# EAGLE design MJ515 - rev.1 - TCAN334 - poc (EAGLE 9.6.2)
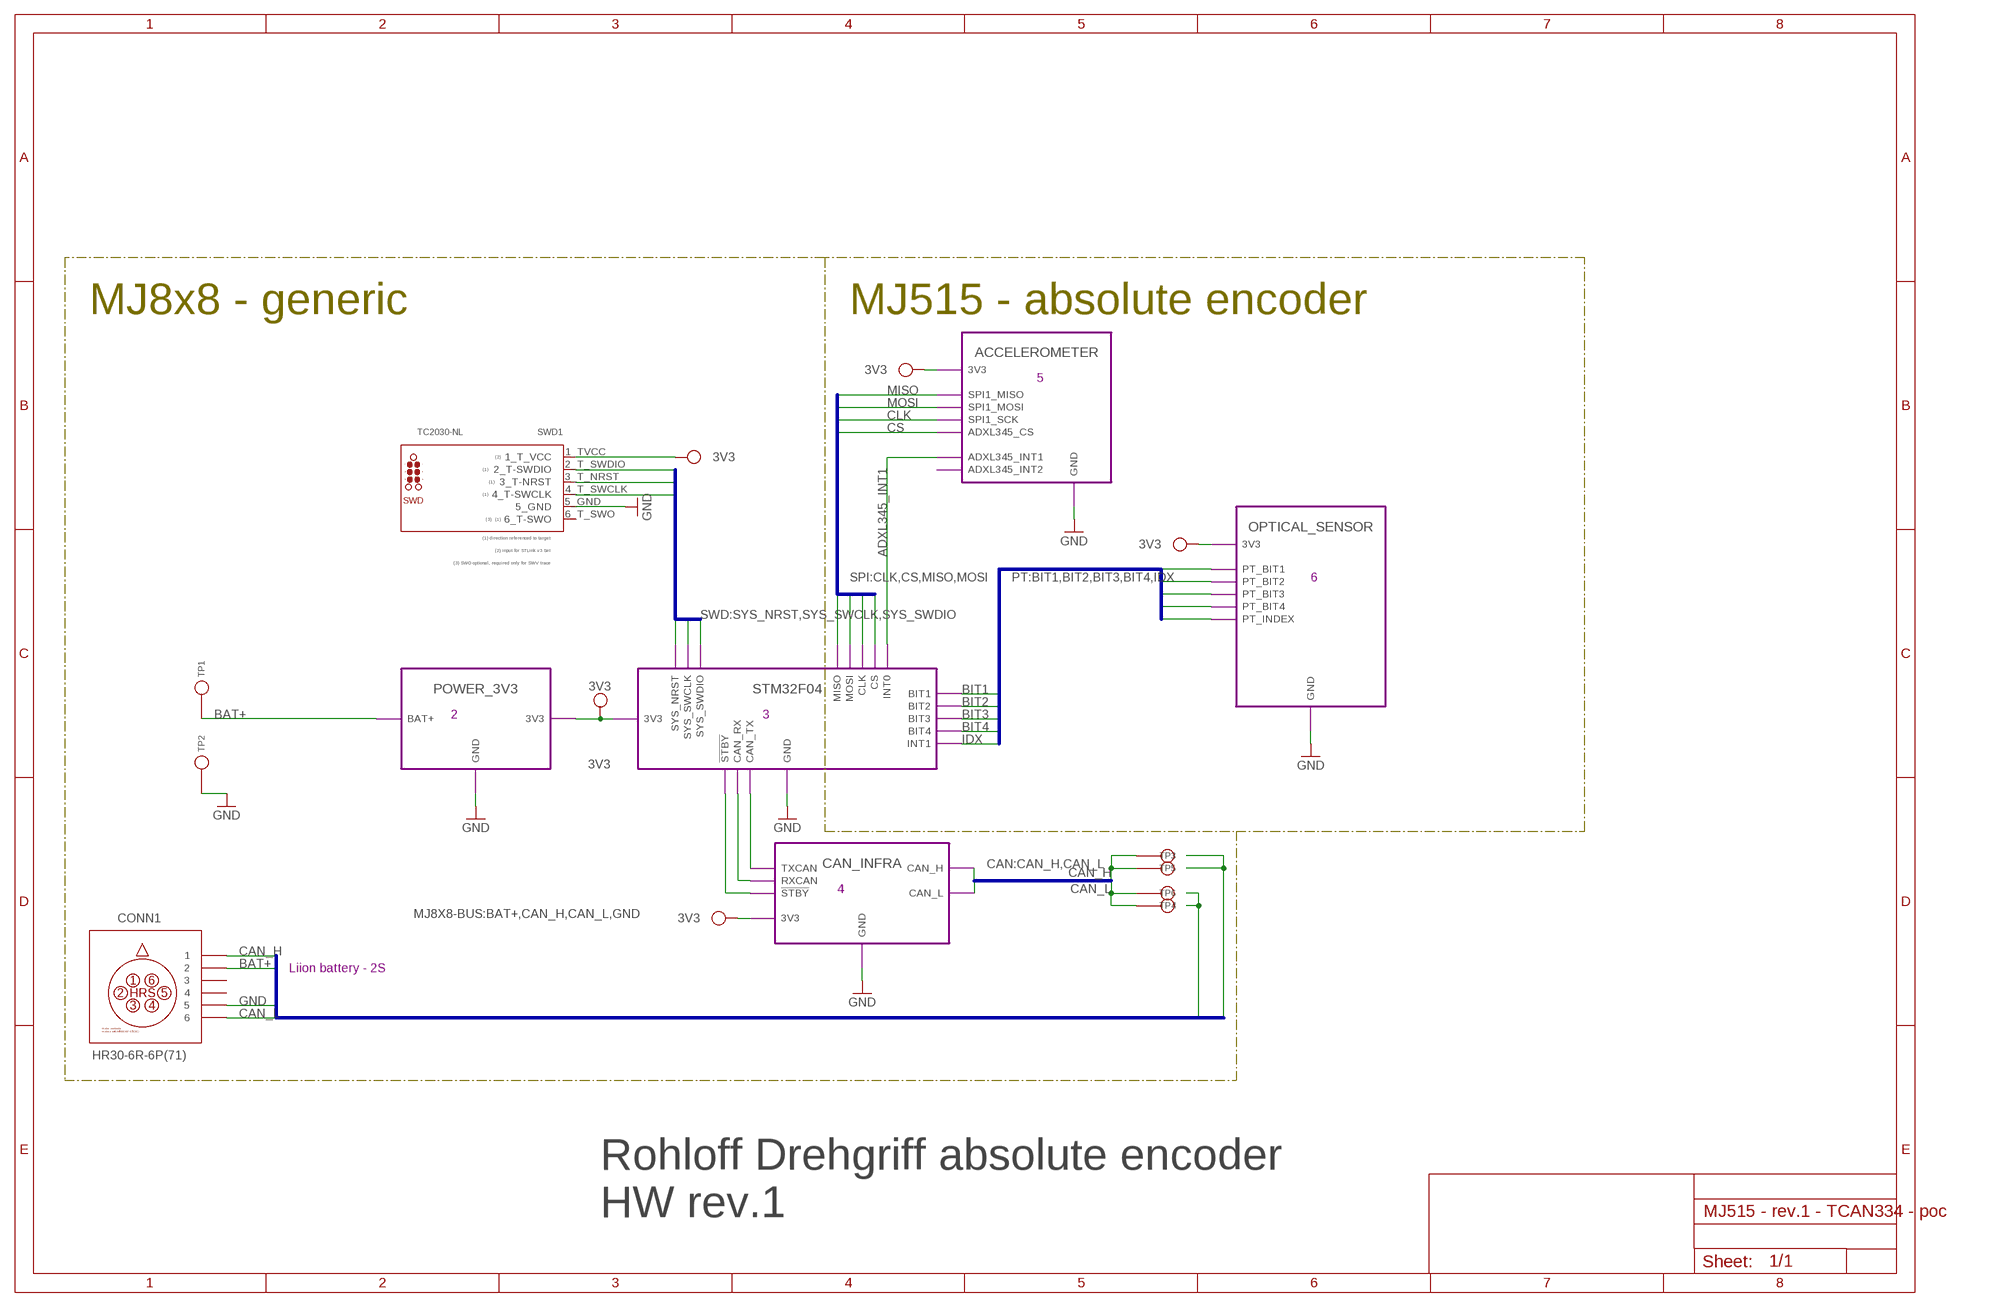
[diagram p0: schematic, sheet 1]

## Parts
CONN1  HR30-6R-6P(71)  HR-30-6R-6X  (no package)
SWD1  TC2030-NL  TC2030  [TC2030-NL]
TP1  LiIon + Terminal  TPTH-0.9  [TH-0.9]
TP2  LiIon - Terminal  TPTH-0.9  [TH-0.9]
TP3  CAN high  TPTH-0.9  [TH-0.9]
TP4  CAN low  TPTH-0.9  [TH-0.9]
TP5  CAN high  TPTH-0.9  [TH-0.9]
TP6  CAN low  TPTH-0.9  [TH-0.9]

## Module instances
POWER_3V3 = POWER_3V3 (part numbers offset by 200)
STM32F04 = STM32 (part numbers offset by 300)
CAN_INFRA = CAN_INFRA (part numbers offset by 400)
ACCELEROMETER = ACCELEROMETER (part numbers offset by 500)
OPTICAL_SENSOR = OPTICAL_SENSOR (part numbers offset by 600)

## Nets
3V3 [3V3]: SWD1.1_TVCC(1_T_VCC) ; port STM32F04.3V3 POWER_3V3.3V3 CAN_INFRA.3V3 OPTICAL_SENSOR.3V3 ACCELEROMETER.3V3
!STBY! [signal]: port CAN_INFRA.!STBY! STM32F04.!STBY!
ADXL345_INT1 [signal]: port ACCELEROMETER.ADXL345_INT1 STM32F04.INT0
BAT+ [BAT+]: CONN1.2 TP1.P$1(TP$1) ; port POWER_3V3.BAT+
BIT1 [signal]: port STM32F04.BIT1 OPTICAL_SENSOR.PT_BIT1
BIT2 [signal]: port STM32F04.BIT2 OPTICAL_SENSOR.PT_BIT2
BIT3 [signal]: port STM32F04.BIT3 OPTICAL_SENSOR.PT_BIT3
BIT4 [signal]: port STM32F04.BIT4 OPTICAL_SENSOR.PT_BIT4
CAN_H [signal]: CONN1.1 TP3.P$1(TP$1) TP5.P$1(TP$1) ; port CAN_INFRA.CAN_H
CAN_L [signal]: CONN1.6 TP4.P$1(TP$1) TP6.P$1(TP$1) ; port CAN_INFRA.CAN_L
CAN_RX [signal]: port CAN_INFRA.RXCAN STM32F04.CAN_RX
CAN_TX [signal]: port CAN_INFRA.TXCAN STM32F04.CAN_TX
CLK [signal]: port ACCELEROMETER.SPI1_SCK STM32F04.CLK
CS [signal]: port ACCELEROMETER.ADXL345_CS STM32F04.CS
GND: CONN1.5 SWD1.5_GND TP2.P$1(TP$1) ; port STM32F04.GND POWER_3V3.GND CAN_INFRA.GND ACCELEROMETER.GND OPTICAL_SENSOR.GND
IDX [signal]: port STM32F04.INT1 OPTICAL_SENSOR.PT_INDEX
MISO [signal]: port ACCELEROMETER.SPI1_MISO STM32F04.MISO
MOSI [signal]: port ACCELEROMETER.SPI1_MOSI STM32F04.MOSI
SYS_NRST [signal]: SWD1.3_T_NRST(3_T-NRST) ; port STM32F04.SYS_NRST
SYS_SWCLK [signal]: SWD1.4_T_SWCLK(4_T-SWCLK) ; port STM32F04.SYS_SWCLK
SYS_SWDIO [signal]: SWD1.2_T_SWDIO(2_T-SWDIO) ; port STM32F04.SYS_SWDIO
Unconnected: CONN1.3 CONN1.4 SWD1.6_T_SWO(6_T-SWO)

## Buses
CAN:CAN_H,CAN_L
SWD:SYS_NRST,SYS_SWCLK,SYS_SWDIO
MJ8X8-BUS:BAT+,CAN_H,CAN_L,GND
SPI:CLK,CS,MISO,MOSI
PT:BIT1,BIT2,BIT3,BIT4,IDX

## Notes on the sheet
- MJ8x8 - generic | MJ515 - absolute encoder
- 5
- 6
- 2 | 3
- 4
- Liion battery - 2S
- Rohloff Drehgriff absolute encoder
  HW rev.1

## Library data of the parts
CONN1 = HR30-6R-6P - PushPull Receptacle:HR-30-6R-6X
SWD1 = tag-connect:TC2030: TC2030 pad no. Function STLink v3 CN1 pin no. Function 1 Reserved (1) 2 Reserved (1) 1 T_Vcc 3 T_Vcc (2) 2 T_SWDIO 4 T_JTMS/T_SWDIO 5 GND 4 T_SWCLK 6 T_JCLK / T_SWCLK 5 GND 7 GND 6 8 T_JTDO / T_SWO (3) 9 T_JRCLK (4) / NC (5) 10 T_JTDI / NC (5) 11 GNDDetect (6) 3 T_NRST 12 T_NRST 13 T_VCP_RX (7) 14 T_VCP_TX (2) (1) Do not connect to the target (2) Input for STLINK-V3SET (3) SWO is optional, required only for Serial Wire Viewer (SWV) trace (4) Optional loopback of T_JCLK on the target side, required if loopback is removed on the STLINK-V3SET side (5) NC means not required for the SWD connection (6) Tied to GND by STLINK-V3SET firmware; may be used by the target for detection of the tool (7) Output for STLINK-V3SET
TP1-TP6 = signal testpoint:TP

## Module POWER_3V3
Ports: GND(pwr) BAT+(pwr) 3V3(pwr)
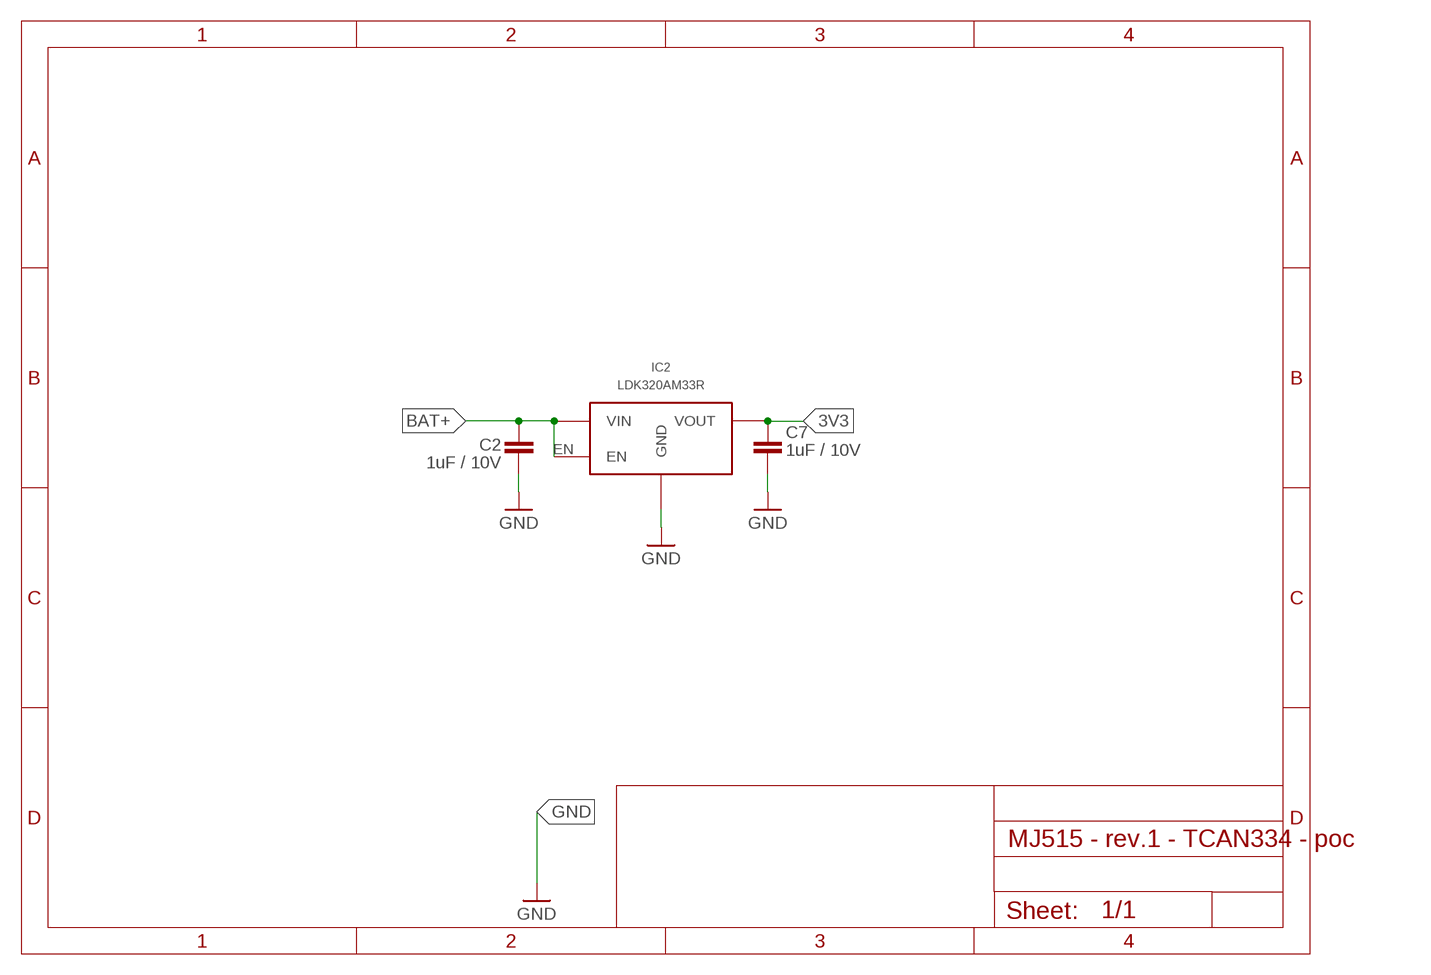
[diagram p1: schematic, module POWER_3V3, sheet 1]

### Parts
C2  1uF / 10V  C-EUC0402  [C0402]
C7  1uF / 10V  C-EUC0402  [C0402]
IC2  LDK320AM33R  LDK320SOT-23-5L  [SOT-23-5L]

### Nets
3V3 [BAT+]: C7.2 IC2.OUT(VOUT)
BAT+: C2.1 IC2.EN IC2.IN(VIN)
GND: C2.2 C7.1 IC2.GND

### Library data of the parts
C2 C7 = rcl:C-EU: CAPACITOR, European symbol; SPICEPREFIX: C
IC2 = LDK320 5V LDO:LDK320

## Module STM32
Ports: GND(pwr) 3V3(pwr) SYS_NRST(in) SYS_SWCLK(io) SYS_SWDIO(io) CAN_RX(in) CAN_TX(out) !STBY!(out) MISO(in) MOSI(out) CLK(out) CS(out) INT0(in) BIT1(in) BIT2(in) BIT3(in) BIT4(in) INT1(in)
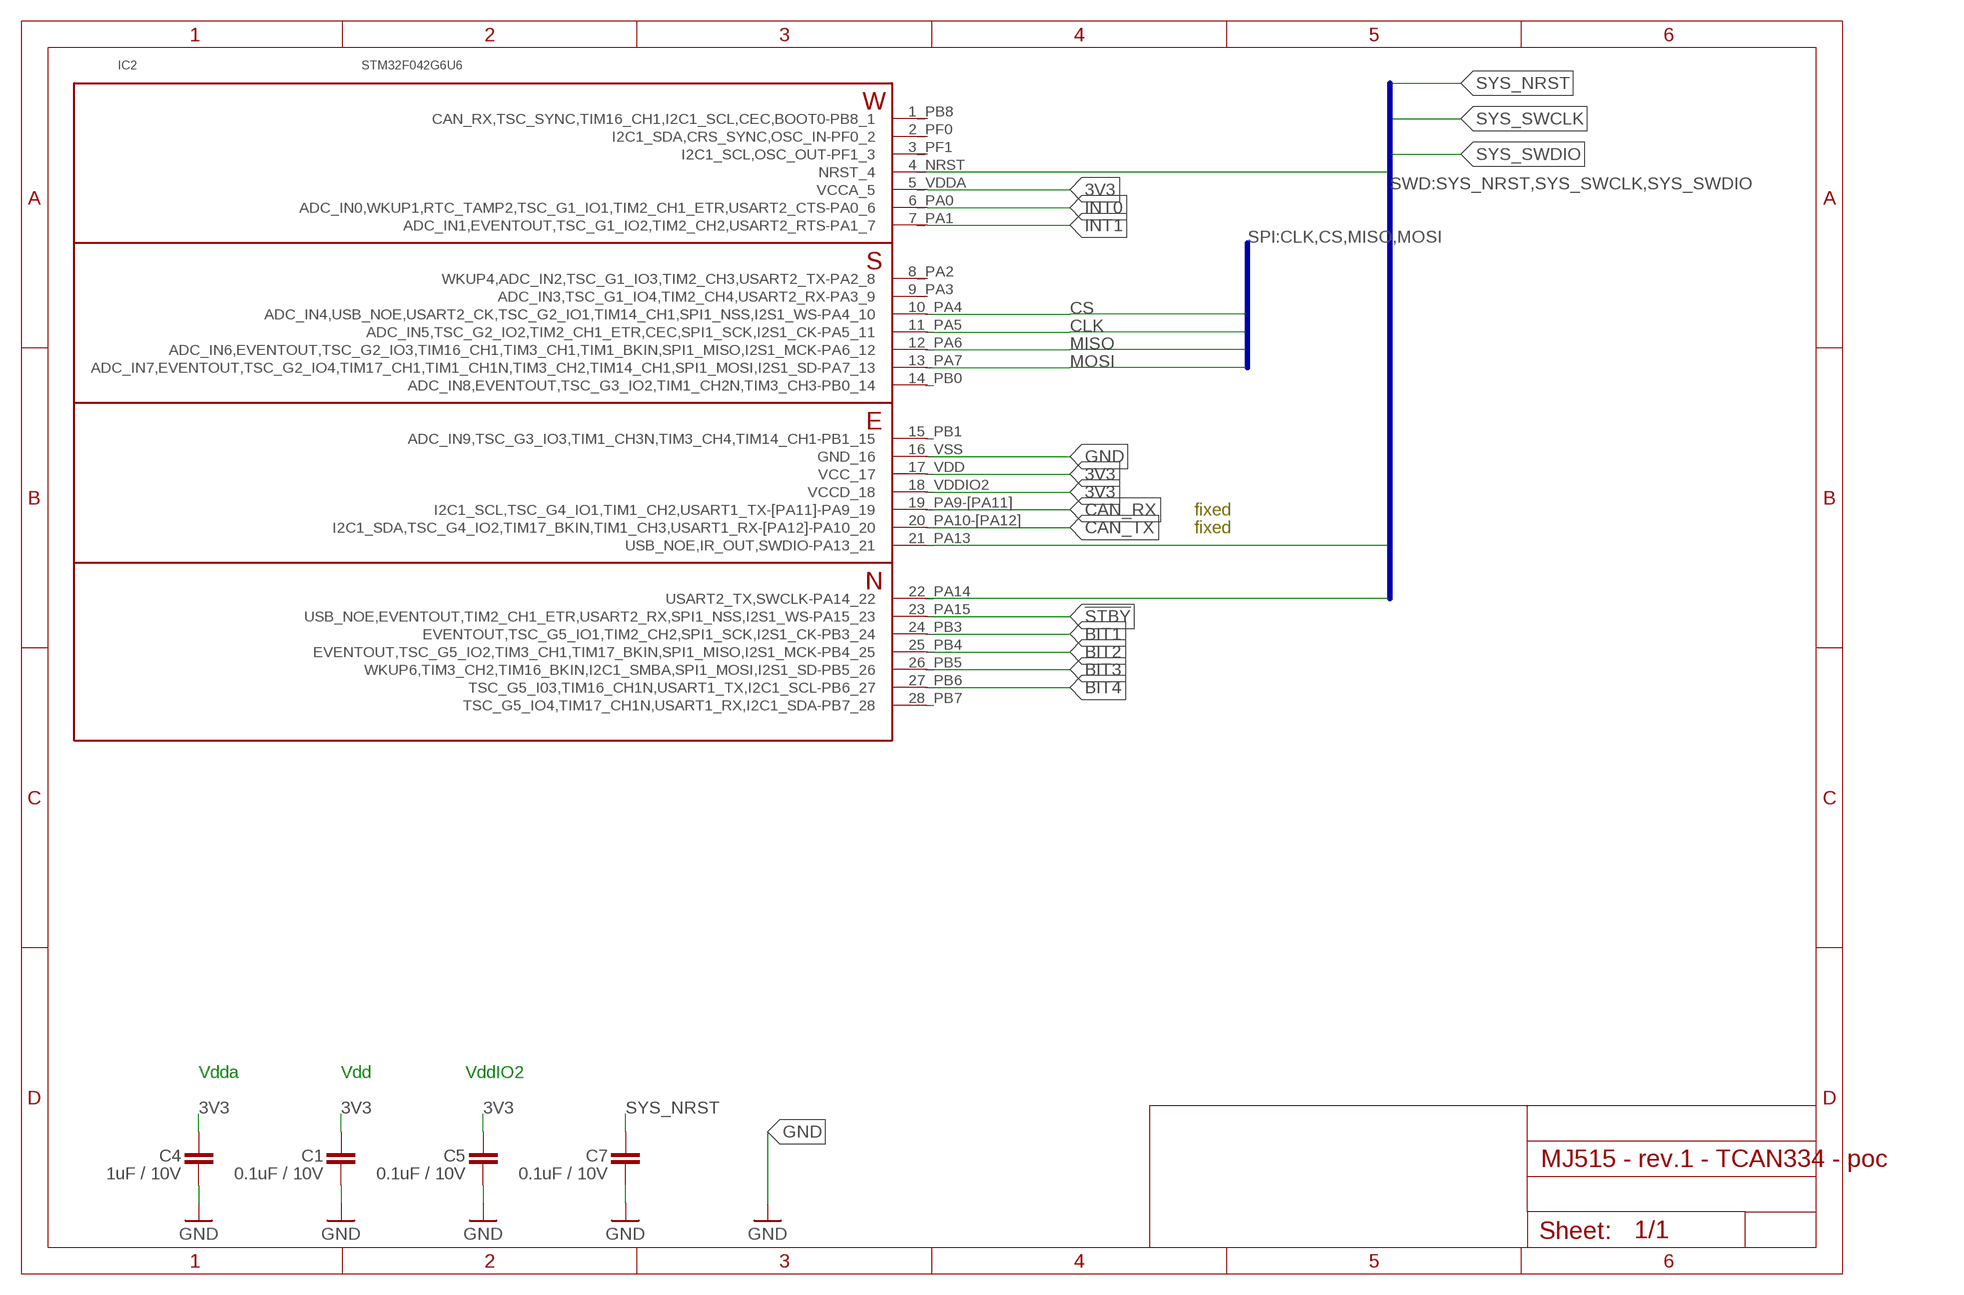
[diagram p2: schematic, module STM32, sheet 1]

### Parts
C1  0.1uF / 10V  C-EUC0402  [C0402]
C4  1uF / 10V  C-EUC0402  [C0402]
C5  0.1uF / 10V  C-EUC0402  [C0402]
C7  0.1uF / 10V  C-EUC0402  [C0402]
IC2  STM32F042G6U6  STM32F042G6  [UFQFPN-28]

### Nets
3V3 [BAT+]: C1.2 C4.2 C5.2 IC2.5_VDDA(VCCA_5) IC2.17_VDD(VCC_17) IC2.18_VDDIO2(VCCD_18)
!STBY!: IC2.23_PA15(USB_NOE,EVENTOUT,TIM2_CH1_ETR,USART2_RX,SPI1_NSS,I2S1_WS-PA15_23)
BIT1 [BAT+]: IC2.24_PB3(EVENTOUT,TSC_G5_IO1,TIM2_CH2,SPI1_SCK,I2S1_CK-PB3_24)
BIT2 [BAT+]: IC2.25_PB4(EVENTOUT,TSC_G5_IO2,TIM3_CH1,TIM17_BKIN,SPI1_MISO,I2S1_MCK-PB4_25)
BIT3 [BAT+]: IC2.26_PB5(WKUP6,TIM3_CH2,TIM16_BKIN,I2C1_SMBA,SPI1_MOSI,I2S1_SD-PB5_26)
BIT4 [BAT+]: IC2.27_PB6(TSC_G5_I03,TIM16_CH1N,USART1_TX,I2C1_SCL-PB6_27)
CAN_RX: IC2.19_PA9-[PA11](I2C1_SCL,TSC_G4_IO1,TIM1_CH2,USART1_TX-[PA11]-PA9_19)
CAN_TX: IC2.20_PA10-[PA12](I2C1_SDA,TSC_G4_IO2,TIM17_BKIN,TIM1_CH3,USART1_RX-[PA12]-PA10_20)
CLK [BAT+]: IC2.11_PA5(ADC_IN5,TSC_G2_IO2,TIM2_CH1_ETR,CEC,SPI1_SCK,I2S1_CK-PA5_11)
CS [BAT+]: IC2.10_PA4(ADC_IN4,USB_NOE,USART2_CK,TSC_G2_IO1,TIM14_CH1,SPI1_NSS,I2S1_WS-PA4_10)
GND: C1.1 C4.1 C5.1 C7.1 IC2.16_VSS(GND_16)
INT0 [BAT+]: IC2.6_PA0(ADC_IN0,WKUP1,RTC_TAMP2,TSC_G1_IO1,TIM2_CH1_ETR,USART2_CTS-PA0_6)
INT1 [BAT+]: IC2.7_PA1(ADC_IN1,EVENTOUT,TSC_G1_IO2,TIM2_CH2,USART2_RTS-PA1_7)
MISO [BAT+]: IC2.12_PA6(ADC_IN6,EVENTOUT,TSC_G2_IO3,TIM16_CH1,TIM3_CH1,TIM1_BKIN,SPI1_MISO,I2S1_MCK-PA6_12)
MOSI [BAT+]: IC2.13_PA7(ADC_IN7,EVENTOUT,TSC_G2_IO4,TIM17_CH1,TIM1_CH1N,TIM3_CH2,TIM14_CH1,SPI1_MOSI,I2S1_SD-PA7_13)
SYS_NRST: C7.2 IC2.4_NRST(NRST_4)
SYS_SWCLK: IC2.22_PA14(USART2_TX,SWCLK-PA14_22)
SYS_SWDIO: IC2.21_PA13(USB_NOE,IR_OUT,SWDIO-PA13_21)
Unconnected: IC2.1_PB8(CAN_RX,TSC_SYNC,TIM16_CH1,I2C1_SCL,CEC,BOOT0-PB8_1) IC2.2_PF0(I2C1_SDA,CRS_SYNC,OSC_IN-PF0_2) IC2.3_PF1(I2C1_SCL,OSC_OUT-PF1_3) IC2.8_PA2(WKUP4,ADC_IN2,TSC_G1_IO3,TIM2_CH3,USART2_TX-PA2_8) IC2.9_PA3(ADC_IN3,TSC_G1_IO4,TIM2_CH4,USART2_RX-PA3_9) IC2.14_PB0(ADC_IN8,EVENTOUT,TSC_G3_IO2,TIM1_CH2N,TIM3_CH3-PB0_14) IC2.15_PB1(ADC_IN9,TSC_G3_IO3,TIM1_CH3N,TIM3_CH4,TIM14_CH1-PB1_15) IC2.28_PB7(TSC_G5_IO4,TIM17_CH1N,USART1_RX,I2C1_SDA-PB7_28)

### Buses
SWD:SYS_NRST,SYS_SWCLK,SYS_SWDIO
SPI:CLK,CS,MISO,MOSI

### Notes on the sheet
- fixed
- fixed
- Vdda | Vdd | VddIO2

### Library data of the parts
C1 C4 C5 C7 = rcl:C-EU: CAPACITOR, European symbol; SPICEPREFIX: C
IC2 = STM32F042G6:STM32F042G6

## Module CAN_INFRA
Ports: GND(pwr) 3V3(pwr) CAN_H(io) CAN_L(io) TXCAN(in) RXCAN(out) !STBY!(in)
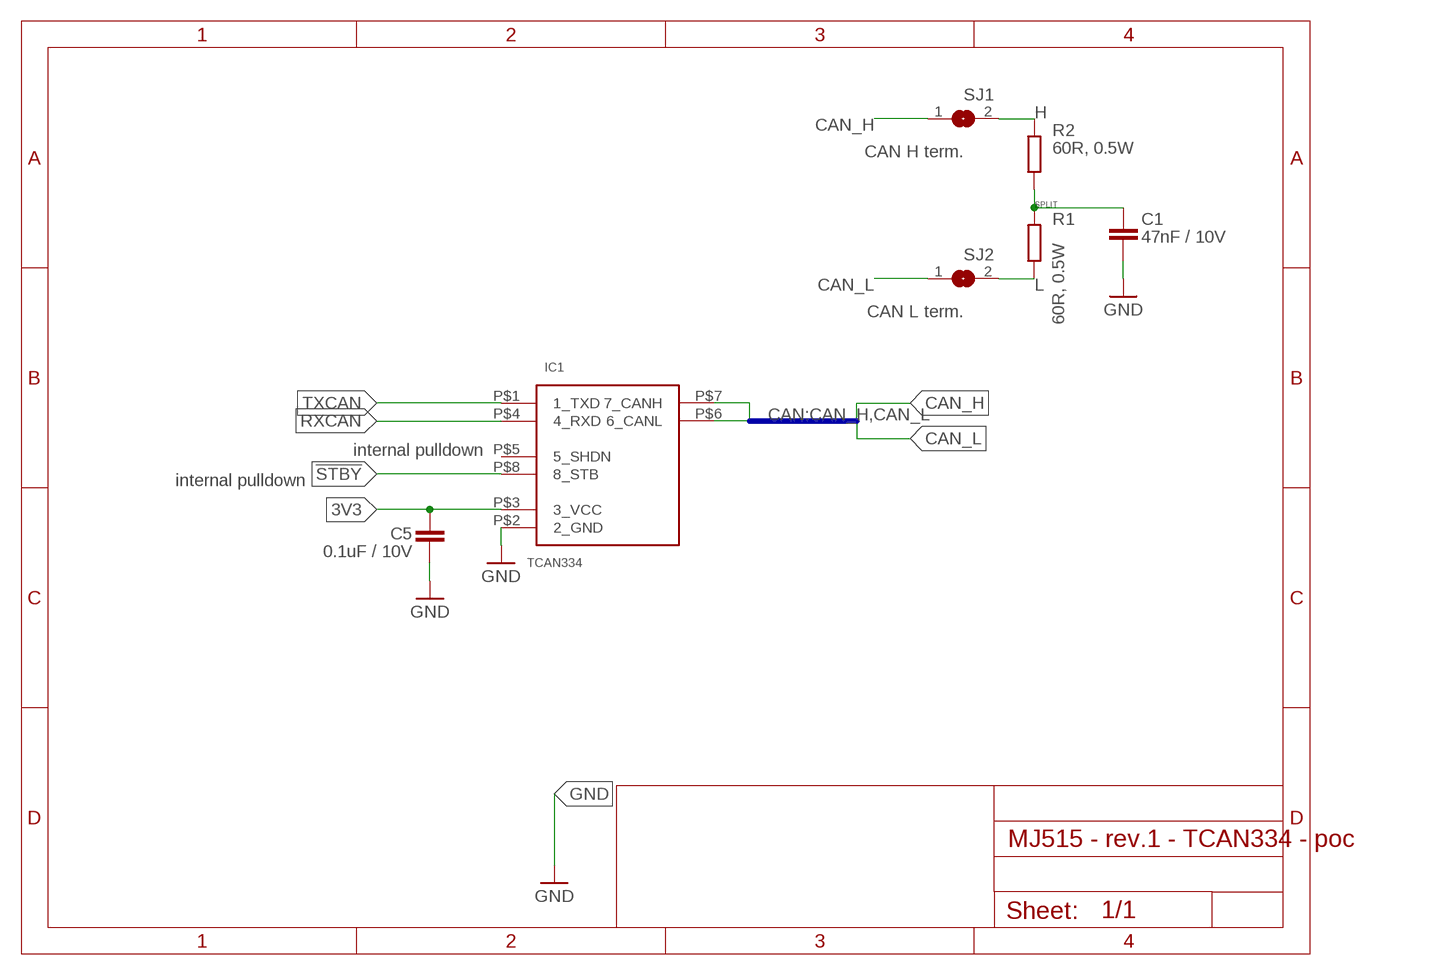
[diagram p3: schematic, module CAN_INFRA, sheet 1]

### Parts
C1  47nF / 10V  C-EUC0402  [C0402]
C5  0.1uF / 10V  C-EUC0402  [C0402]
IC1  TCAN334  CAN33X  [SOT23-8]
R1  60R, 0.5W  R-EU_R0805  [R0805]
R2  60R, 0.5W  R-EU_R0805  [R0805]
SJ1  CAN H term.  SJ  [SJ]
SJ2  CAN L term.  SJ  [SJ]

### Nets
3V3 [BAT+]: C5.1 IC1.P$3(3_VCC)
!STBY! [signal]: IC1.P$8(8_STB)
CAN_H: IC1.P$7(7_CANH) SJ1.1
CAN_L: IC1.P$6(6_CANL) SJ2.1
GND: C1.2 C5.2 IC1.P$2(2_GND)
H: R2.2 SJ1.2
L: R1.1 SJ2.2
RXCAN [signal]: IC1.P$4(4_RXD)
SPLIT [signal]: C1.1 R1.2 R2.1
TXCAN [signal]: IC1.P$1(1_TXD)
Unconnected: IC1.P$5(5_SHDN)

### Buses
CAN:CAN_H,CAN_L

### Notes on the sheet
- internal pulldown
- internal pulldown

### Library data of the parts
C1 C5 = rcl:C-EU: CAPACITOR, European symbol; SPICEPREFIX: C
IC1 = TCAN33x - 3.3V CAN Transciever:CAN33X
R1 R2 = rcl:R-EU_: RESISTOR, European symbol; SPICEPREFIX: R
SJ1 SJ2 = jumper:SJ: SMD solder JUMPER

## Module ACCELEROMETER
Ports: GND(pwr) 3V3(pwr) SPI1_MISO(out) SPI1_MOSI(in) SPI1_SCK(in) ADXL345_CS(in) ADXL345_INT2(out) ADXL345_INT1(out)
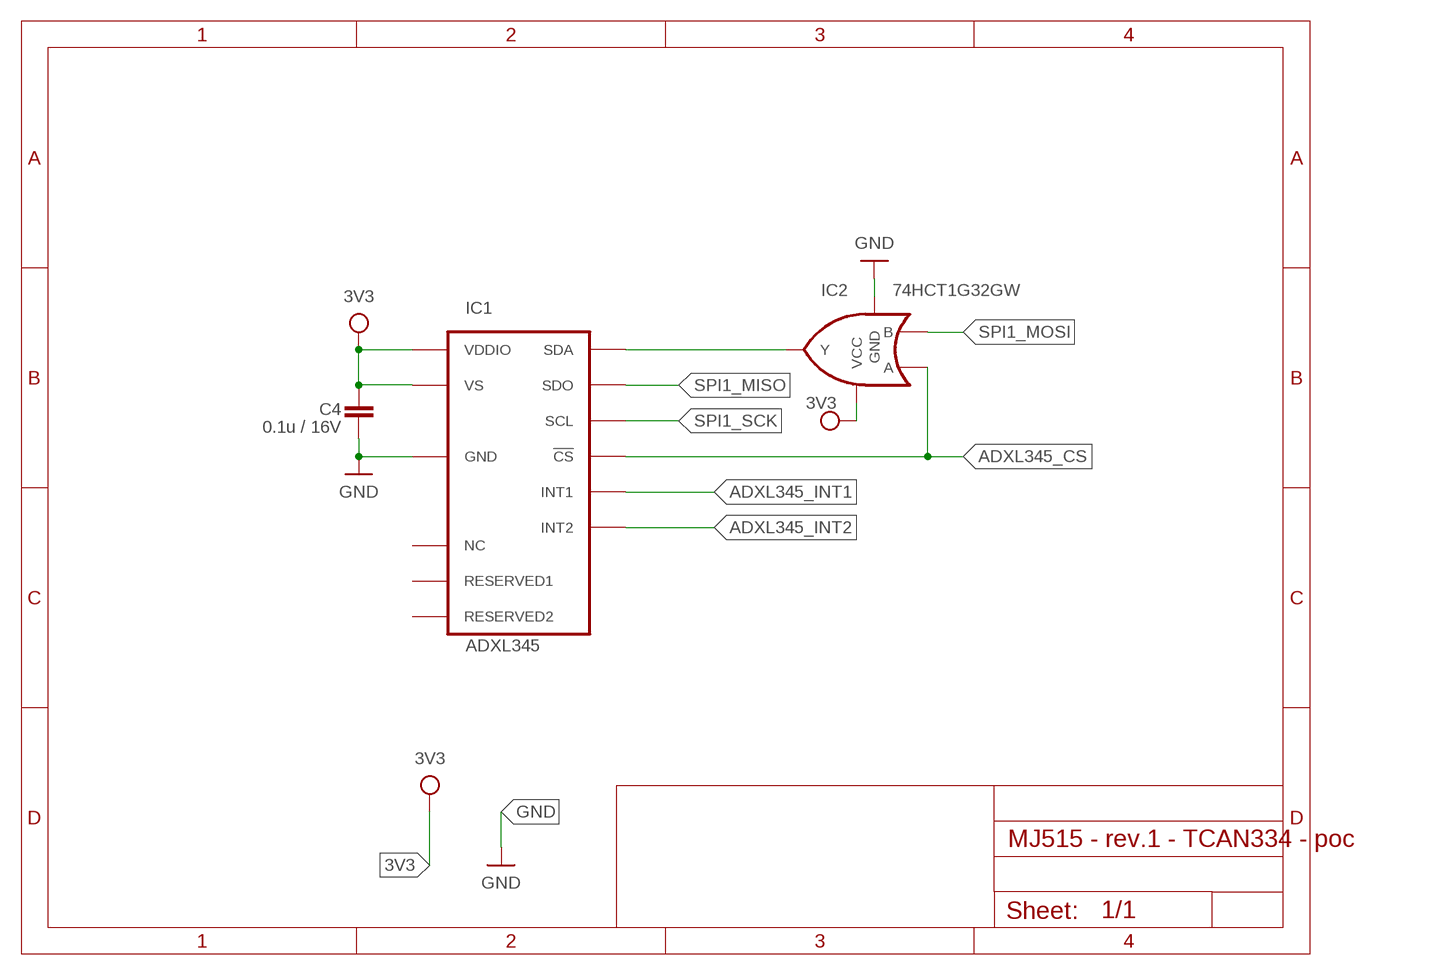
[diagram p4: schematic, module ACCELEROMETER, sheet 1]

### Parts
C4  0.1u / 16V  C-EUC0402  [C0402]
IC1  ADXL345  [LGA14]
IC2  74HCT1G32GW  74HCT1G32GW-DC  [SOT353/5]

### Nets
3V3: C4.1 IC1.VCC(VS) IC1.VDD(VDDIO) IC2.VCC
ADXL345_CS [3V3]: IC1.!CS! IC2.A
ADXL345_INT1 [3V3]: IC1.INT1
ADXL345_INT2 [3V3]: IC1.INT2
ADXL345SDA [3V3]: IC1.SDA IC2.Y
GND: C4.2 IC1.GND1(GND) IC1.GND2(GND) IC1.GND3(GND) IC2.GND
SPI1_MISO [3V3]: IC1.SDO
SPI1_MOSI [3V3]: IC2.B
SPI1_SCK [3V3]: IC1.SCL
Unconnected: IC1.NC IC1.RESERVED1 IC1.RESERVED2

### Library data of the parts
C4 = rcl:C-EU: CAPACITOR, European symbol
IC1 = ADXL345 Accelerometer:ADXL345: 3-Axis, ±2 g/±4 g/±8 g/±16 g Digital Accelerometer
IC2 = 74HCT1G32GW - OR Gate:74HCT1G32GW: Two Input OR gate

## Module OPTICAL_SENSOR
Ports: GND(pwr) 3V3(pwr) PT_BIT1(out) PT_BIT2(out) PT_BIT4(out) PT_BIT3(out) PT_INDEX(out)
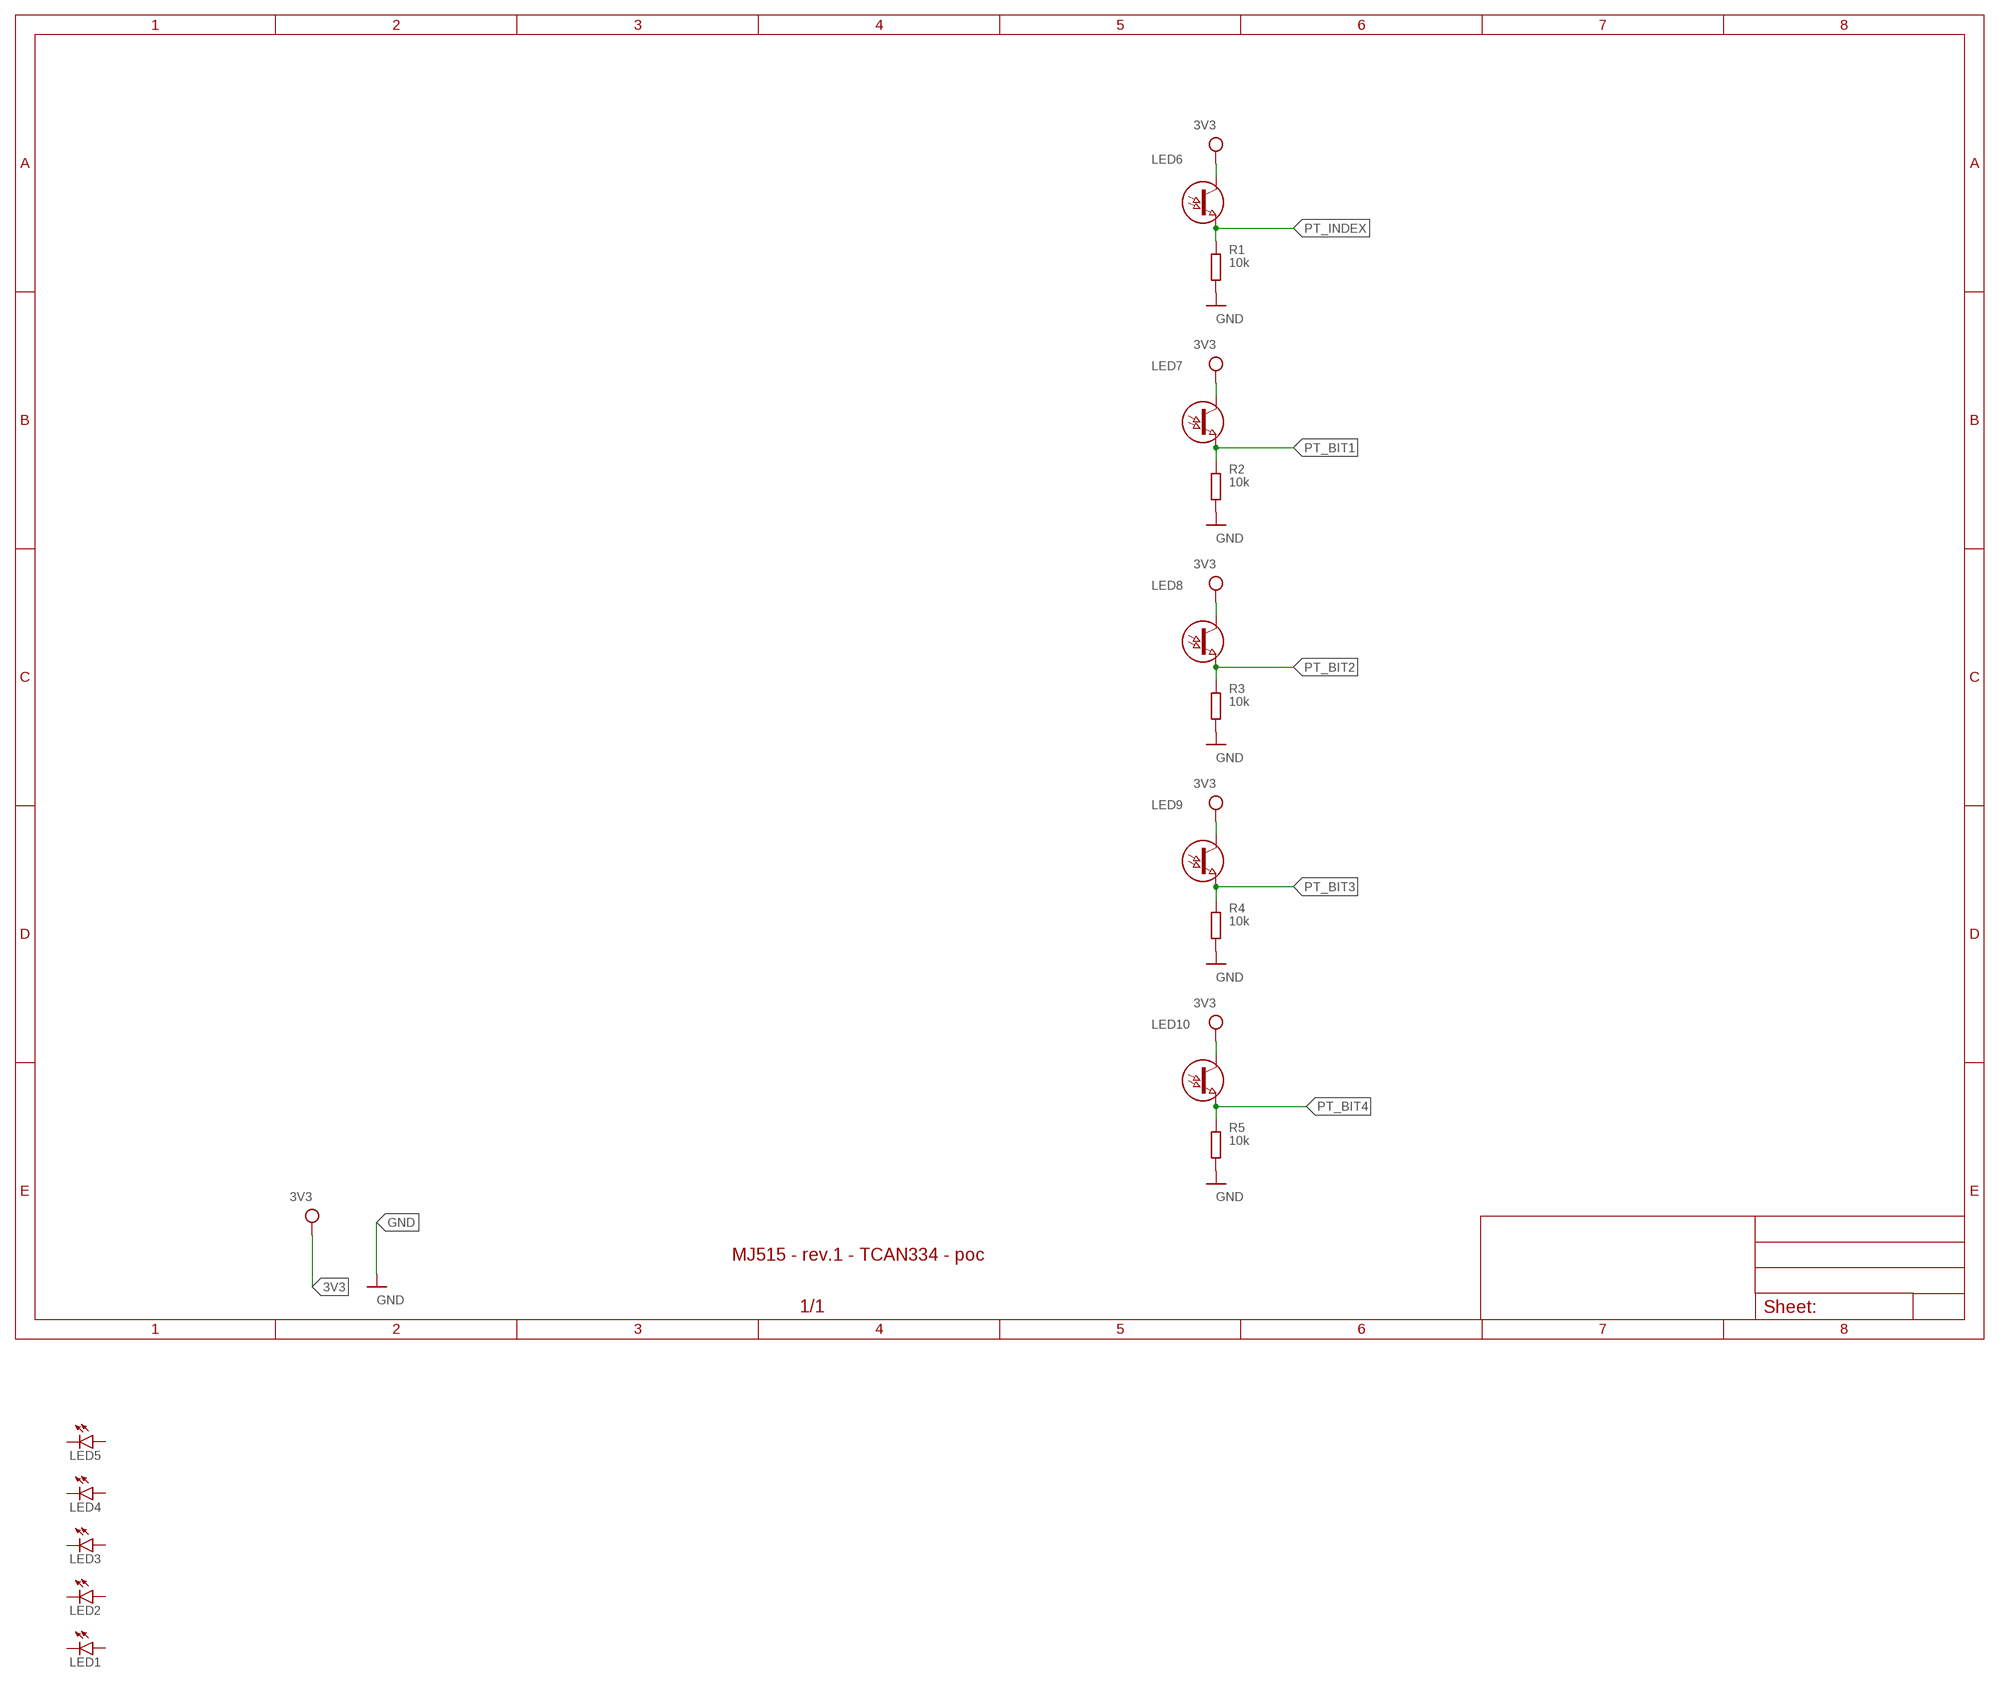
[diagram p5: schematic, module OPTICAL_SENSOR, sheet 1]

### Parts
LED1  LEDCHIP-LED0603  [CHIP-LED0603]
LED2  LEDCHIP-LED0603  [CHIP-LED0603]
LED3  LEDCHIP-LED0603  [CHIP-LED0603]
LED4  LEDCHIP-LED0603  [CHIP-LED0603]
LED5  LEDCHIP-LED0603  [CHIP-LED0603]
LED6  1540601NEA200  [0603]
LED7  1540601NEA200  [0603]
LED8  1540601NEA200  [0603]
LED9  1540601NEA200  [0603]
LED10  1540601NEA200  [0603]
R1  10k  R-EU_R0402  [R0402]
R2  10k  R-EU_R0402  [R0402]
R3  10k  R-EU_R0402  [R0402]
R4  10k  R-EU_R0402  [R0402]
R5  10k  R-EU_R0402  [R0402]

### Nets
3V3 [3V3]: LED6.C LED7.C LED8.C LED9.C LED10.C
GND: R1.1 R2.1 R3.1 R4.1 R5.1
PT_BIT1 [signal]: LED7.E R2.2
PT_BIT2 [signal]: LED8.E R3.2
PT_BIT3 [signal]: LED9.E R4.2
PT_BIT4 [signal]: LED10.E R5.2
PT_INDEX [signal]: LED6.E R1.2
Unconnected: LED1.A LED1.C LED2.A LED2.C LED3.A LED3.C LED4.A LED4.C LED5.A LED5.C

### Library data of the parts
LED1-LED5 = led:LED: LED OSRAM: - CHIPLED LG R971, LG N971, LY N971, LG Q971, LY Q971, LO R971, LY R971 LH N974, LH R974 LS Q976, LO Q976, LY Q976 LO Q996 - Hyper CHIPLED LW Q18S LB Q993, LB Q99A, LB R99A - SideLED LS A670, LO A670, LY A670, LG A670, LP A670 LB A673, LV A673, LT A673, LW A673 LH A674 LY A675 LS A676, LA A676, LO A676, LY A676, LW A676 LS A679, LY A679, LG A679 - Hyper Micro SIDELED® LS Y876, LA Y876, LO Y876, LY Y876 LT Y87S - SmartLED LW L88C, LW L88S LB L89C, LB L89S, LG L890 LS L89K, LO L89K, LY L89K LS L896, LA L896, LO L896, LY L896 - TOPLED LS T670, LO T670, LY T670, LG T670, LP T670 LSG T670, LSP T670, LSY T670, LOP T670, LYG T670 LG T671, LOG T671, LSG T671 LB T673, LV T673, LT T673, LW T673 LH T674 LS T676, LA T676, LO T676, LY T676, LB T676, LH T676, LSB T676, LW T676 LB T67C, LV T67C, LT T67C, LS T67K, LO T67K, LY T67K, LW E67C LS E67B, LA E67B, LO E67B, LY E67B, LB E67C, LV E67C, LT E67C LW T67C LS T679, LY T679, LG T679 LS T770, LO T770, LY T770, LG T770, LP T770 LB T773, LV T773, LT T773, LW T773 LH T774 LS E675, LA E675, LY E675, LS T675 LS T776, LA T776, LO T776, LY T776, LB T776 LHGB T686 LT T68C, LB T68C - Hyper Mini TOPLED® LB M676 - Mini TOPLED Santana® LG M470 LS M47K, LO M47K, LY M47K Source: http://www.osram.convergy.de LUXEON: - LUMILED® LXK2-PW12-R00, LXK2-PW12-S00, LXK2-PW14-U00, LXK2-PW14-V00 LXK2-PM12-R00, LXK2-PM12-S00, LXK2-PM14-U00 LXK2-PE12-Q00, LXK2-PE12-R00, LXK2-PE12-S00, LXK2-PE14-T00, LXK2-PE14-U00 LXK2-PB12-K00, LXK2-PB12-L00, LXK2-PB12-M00, LXK2-PB14-N00, LXK2-PB14-P00, LXK2-PB14-Q00 LXK2-PR12-L00, LXK2-PR12-M00, LXK2-PR14-Q00, LXK2-PR14-R00 LXK2-PD12-Q00, LXK2-PD12-R00, LXK2-PD12-S00 LXK2-PH12-R00, LXK2-PH12-S00 LXK2-PL12-P00, LXK2-PL12-Q00, LXK2-PL12-R00 Source: www.luxeon.com KINGBRIGHT: KA-3528ASYC Source: www.kingbright.com
LED6-LED10 = 1540601NEA200 - Phototransistor:1540601NEA200
R1-R5 = rcl:R-EU_: RESISTOR, European symbol; SPICEPREFIX: R

## Net classes
0 GND: width 0.25 mm, drill 0.35 mm, clearance 0.19 mm
2 3V3: width 0.25 mm, drill 0.35 mm, clearance 0.19 mm
3 signal: width 0.25 mm, drill 0.35 mm, clearance 0.19 mm
4 BAT+: width 0.5 mm, drill 0.35 mm, clearance 0.19 mm

## Board
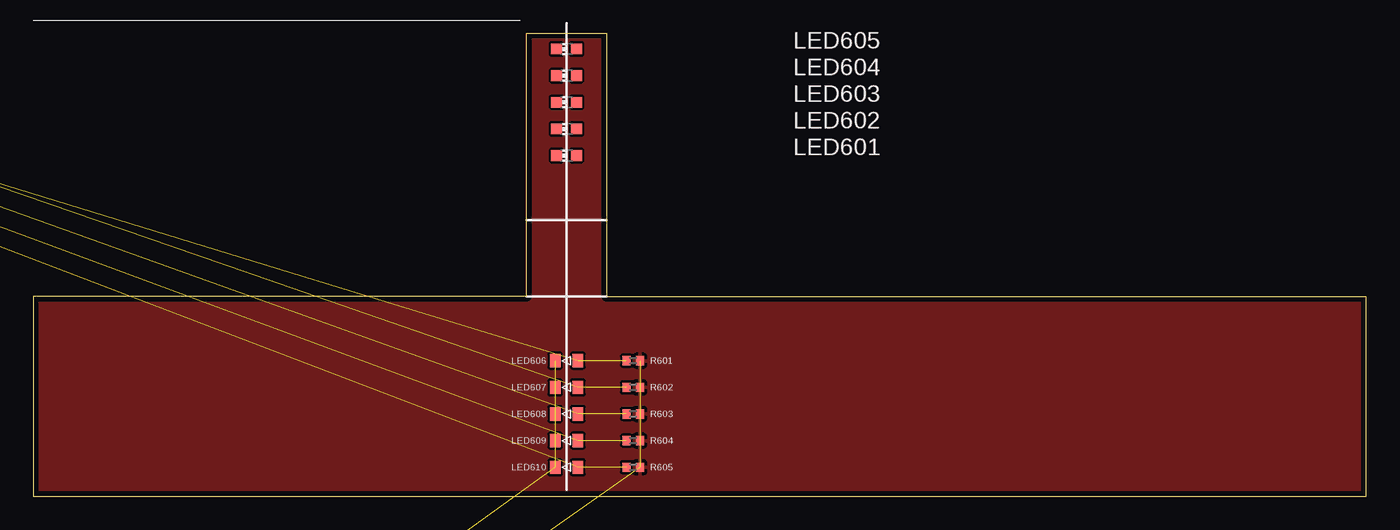
[diagram p6: board, top side]
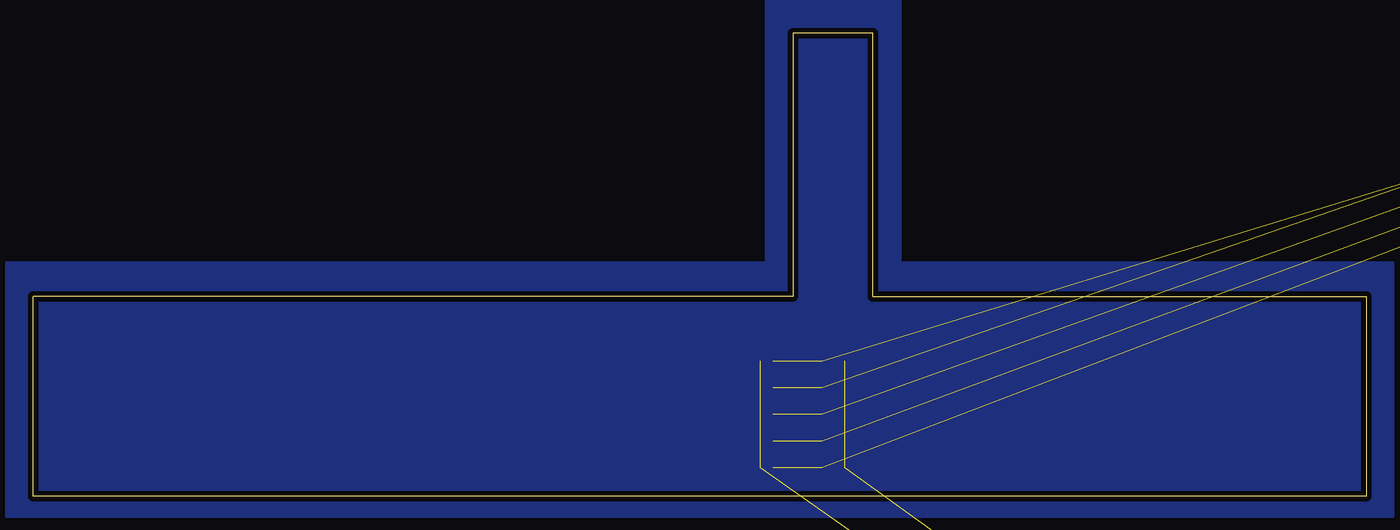
[diagram p7: board, bottom side, seen from below]

Size 100 x 34.75 mm. Coordinates in mm from the lower left corner, seen from the top.
Outline: 0,15 0,0 100,0 100,15 43,15 43,34.75 37,34.75 37,15 0,15
Copper layers (1*16): Top 0.035559375mm / dielectric 1.6mm / Bottom 0.035559375mm
Design rules "oshpark-2layer": minimum track width 6mil, minimum drill 10mil, track to track 6mil, track to pad 6mil, pad to pad 6mil, via to via 6mil, smd to smd 6mil, copper to edge 15mil, drill to drill 6mil, minimum pad ring 5mil, minimum via ring 5mil, stop-mask expansion 2.5mil, vias tented up to drill 0mil, thermal gap 10mil

### Footprints (pad centres in the part's own frame; a part is rotated, then mirrored left to right if it is on the bottom)
C0402 = smd 0.7 x 0.9: 1 -0.65,0; 2 0.65,0
SOT-23-5L = smd 0.6 x 1.2: ADJ/NC -0.95,-1.15; EN -0.95,1.15; GND 0,1.15; IN 0.95,1.15; OUT 0.95,-1.15
UFQFPN-28 = smd 0.55 x 0.3: 1_PB8 -2.08,1.5; 7_PA1 -2.08,-1.5; 15_PB1 2.08,-1.5; 21_PA13 2.08,1.5 | smd 0.75 x 0.3: 2_PF0 -1.98,1; 3_PF1 -1.98,0.5; 4_NRST -1.98,0; 5_VDDA -1.98,-0.5; 6_PA0 -1.98,-1; 16_VSS 1.98,-1; 17_VDD 1.98,-0.5; 18_VDDIO2 1.98,0; 19_PA9-[PA11] 1.98,0.5; 20_PA10-[PA12] 1.98,1 | smd 0.3 x 0.55: 8_PA2 -1.5,-2.08; 14_PB0 1.5,-2.08; 22_PA14 1.5,2.08; 28_PB7 -1.5,2.08 | smd 0.3 x 0.75: 9_PA3 -1,-1.98; 10_PA4 -0.5,-1.98; 11_PA5 0,-1.98; 12_PA6 0.5,-1.98; 13_PA7 1,-1.98; 23_PA15 1,1.98; 24_PB3 0.5,1.98; 25_PB4 0,1.98; 26_PB5 -0.5,1.98; 27_PB6 -1,1.98
SOT23-8 = smd 0.45 x 1.1: P$1 -0.975,-1.275; P$2 -0.325,-1.275; P$3 0.325,-1.275; P$4 0.975,-1.275; P$5 0.975,1.275; P$6 0.325,1.275; P$7 -0.325,1.275; P$8 -0.975,1.275
LGA14 = smd 0.5 x 1.5: !CS! 0,-2.3; SCL 0,2.3 | smd 1.5 x 0.5: GND1 -1.3,-1.2; GND2 -1.3,-0.4; GND3 -1.3,1.2; INT1 1.3,-2; INT2 1.3,-1.2; NC 1.3,-0.4; RESERVED1 1.3,0.4; RESERVED2 -1.3,0.4; SDA 1.3,2; SDO 1.3,1.2; VCC -1.3,-2; VDD -1.276,1.995
SOT353/5 = smd 0.4 x 1.2: A 0,-0.9; B -0.65,-0.9; GND 0.65,-0.9; VCC -0.65,0.9; Y 0.65,0.9
CHIP-LED0603 = smd 0.8 x 0.8: A 0,-0.75; C 0,0.75
0603 = smd 0.8 x 1: C -0.85,0; E 0.85,0
R0805 = smd 1.3 x 1.5: 1 -0.95,0; 2 0.95,0
R0402 = smd 0.6 x 0.7: 1 -0.5,0; 2 0.5,0
SJ = smd 1.168 x 1.6: 1 -0.762,0; 2 0.762,0
TC2030-NL = smd 0.787 x 0.787: 1_TVCC 1.27,-0.635; 2_T_SWDIO 1.27,0.635; 3_T_NRST 2.54,-0.635; 4_T_SWCLK 2.54,0.635; 5_GND 3.81,-0.635; 6_T_SWO 3.81,0.635 | hole 0.991: 0,0; 5.08,-1.016; 5.08,1.016
TH-0.9 = drill 0.9: P$1 0,0

### Placement (x,y rotation side)
C202  1uF / 10V  [C0402]  -97.25,48 0 top  (outside the outline)
C207  1uF / 10V  [C0402]  -97.25,52.99 0 top  (outside the outline)
C301  0.1uF / 10V  [C0402]  -110.25,58 90 top  (outside the outline)
C304  1uF / 10V  [C0402]  -119.25,58 90 top  (outside the outline)
C305  0.1uF / 10V  [C0402]  -110.25,61.5 270 top  (outside the outline)
C307  0.1uF / 10V  [C0402]  -119.25,61.5 270 top  (outside the outline)
C401  47nF / 10V  [C0402]  -121,43.25 0 top  (outside the outline)
C405  0.1uF / 10V  [C0402]  -123.5,54 270 top  (outside the outline)
C504  0.1u / 16V  [C0402]  -64.75,-92 0 top  (outside the outline)
IC202  LDK320AM33R  [SOT-23-5L]  -97.25,50.5 90 top  (outside the outline)
IC302  STM32F042G6U6  [UFQFPN-28]  -114.75,60 0 top  (outside the outline)
IC401  TCAN334  [SOT23-8]  -121,54 180 top  (outside the outline)
IC501  ADXL345  [LGA14]  -59.25,-84.75 0 top  (outside the outline)
IC502  74HCT1G32GW  [SOT353/5]  -63.25,-73 0 top  (outside the outline)
LED601  [CHIP-LED0603]  40,25.57 90 top
LED602  [CHIP-LED0603]  40,27.57 90 top
LED603  [CHIP-LED0603]  40,29.57 90 top
LED604  [CHIP-LED0603]  40,31.57 90 top
LED605  [CHIP-LED0603]  40,33.57 90 top
LED606  [0603]  40,10.18 0 top
LED607  [0603]  40,8.18 0 top
LED608  [0603]  40,6.17 0 top
LED609  [0603]  40,4.17 0 top
LED610  [0603]  40,2.17 0 top
R401  60R, 0.5W  [R0805]  -122.25,46 270 top  (outside the outline)
R402  60R, 0.5W  [R0805]  -119.75,46 90 top  (outside the outline)
R601  10k  [R0402]  45,10.18 180 top
R602  10k  [R0402]  45,8.18 180 top
R603  10k  [R0402]  45,6.17 180 top
R604  10k  [R0402]  45,4.17 180 top
R605  10k  [R0402]  45,2.17 180 top
SJ401  CAN H term.  [SJ]  -119.75,49.75 270 bottom  (outside the outline)
SJ402  CAN L term.  [SJ]  -122.25,49.75 270 bottom  (outside the outline)
SWD1  -107,57 90 bottom  (outside the outline)
TP1  -99.75,48.5 90 bottom  (outside the outline)
TP2  -99.75,52.5 90 bottom  (outside the outline)
TP3  -175,-95.5 0 top  (outside the outline)
TP4  -175,-98.5 0 top  (outside the outline)
TP5  -118,50.5 0 bottom  (outside the outline)
TP6  -124,50.5 0 bottom  (outside the outline)

### Tracks (layer width: path | path; a pad name or v marks a point on that pad's centre or on a via)
3V3  (19 unrouted)
  pour Top (no thermals): -96.75,53.5 -96.75,51.12 -94.88,51.12 -94.88,53.5
!STBY!  (1 unrouted)
ACCELEROMETER:ADXL345SDA  (1 unrouted)
ADXL345_INT1  (1 unrouted)
BAT+  (3 unrouted)
  pour Top (no thermals): -100.25,49.88 -100.25,47.5 -97.5,47.5 -97.5,49.88
BIT1  (2 unrouted)
BIT2  (2 unrouted)
BIT3  (2 unrouted)
BIT4  (2 unrouted)
CAN_H  (3 unrouted)
CAN_INFRA:H  (1 unrouted)
CAN_INFRA:L  (1 unrouted)
CAN_INFRA:SPLIT
  pour Top (no thermals): -123,45.62 -119,45.62 -119,44.38 -121.25,44.38 -121.25,42.75 -122,42.75 -122,43.38 -123,44.38
CAN_L  (3 unrouted)
CAN_RX  (1 unrouted)
CAN_TX  (1 unrouted)
CLK  (1 unrouted)
CS  (2 unrouted)
CUT1
  cutout Top: -108.88,62.12 -108.88,57.12 arc90 -107.88,56.12 -106.12,56.12 arc90 -105.12,57.12 -105.12,62.12 arc90 -106.12,63.12 -107.88,63.12 arc90
CUT2
  cutout Bottom: -105.12,62.12 -105.12,57.12 arc-90 -106.12,56.12 -107.88,56.12 arc-90 -108.88,57.12 -108.88,62.12 arc-90 -107.88,63.12 -106.12,63.12 arc-90
GND  (22 unrouted)
  pour Top: 35,37.5 35,17.5 -2,17.5 -2,-1.5 102,-1.5 102,17.5 45,17.5 45,37.5
  pour Bottom: 35,37.5 35,17.5 -2,17.5 -2,-1.5 102,-1.5 102,17.5 45,17.5 45,37.5
IDX  (2 unrouted)
MISO  (1 unrouted)
MOSI  (1 unrouted)
SYS_NRST  (2 unrouted)
SYS_SWCLK  (1 unrouted)
SYS_SWDIO  (1 unrouted)

### Text on the board
Top: GND | GND | GND | GND
Bottom: FRONT_LED_DRIVER:DIM_FRONT_DRAIN | FRONT_LED_DRIVER:DIM_FRONT_DRAIN | FRONT_LED_DRIVER:DIM_FRONT_DRAIN | FRONT_LED_DRIVER:DIM_FRONT_DRAIN
bPlace: GND | L | H | CAN term. | BAT+
bStop: MJ-808 clone / SuperNova E3 / ejovrh rev. 5a
Document: SuperNova E3 housing